# Altium schematic sheet 4-PWR_MANAGE_3.SCHDOC
size A4
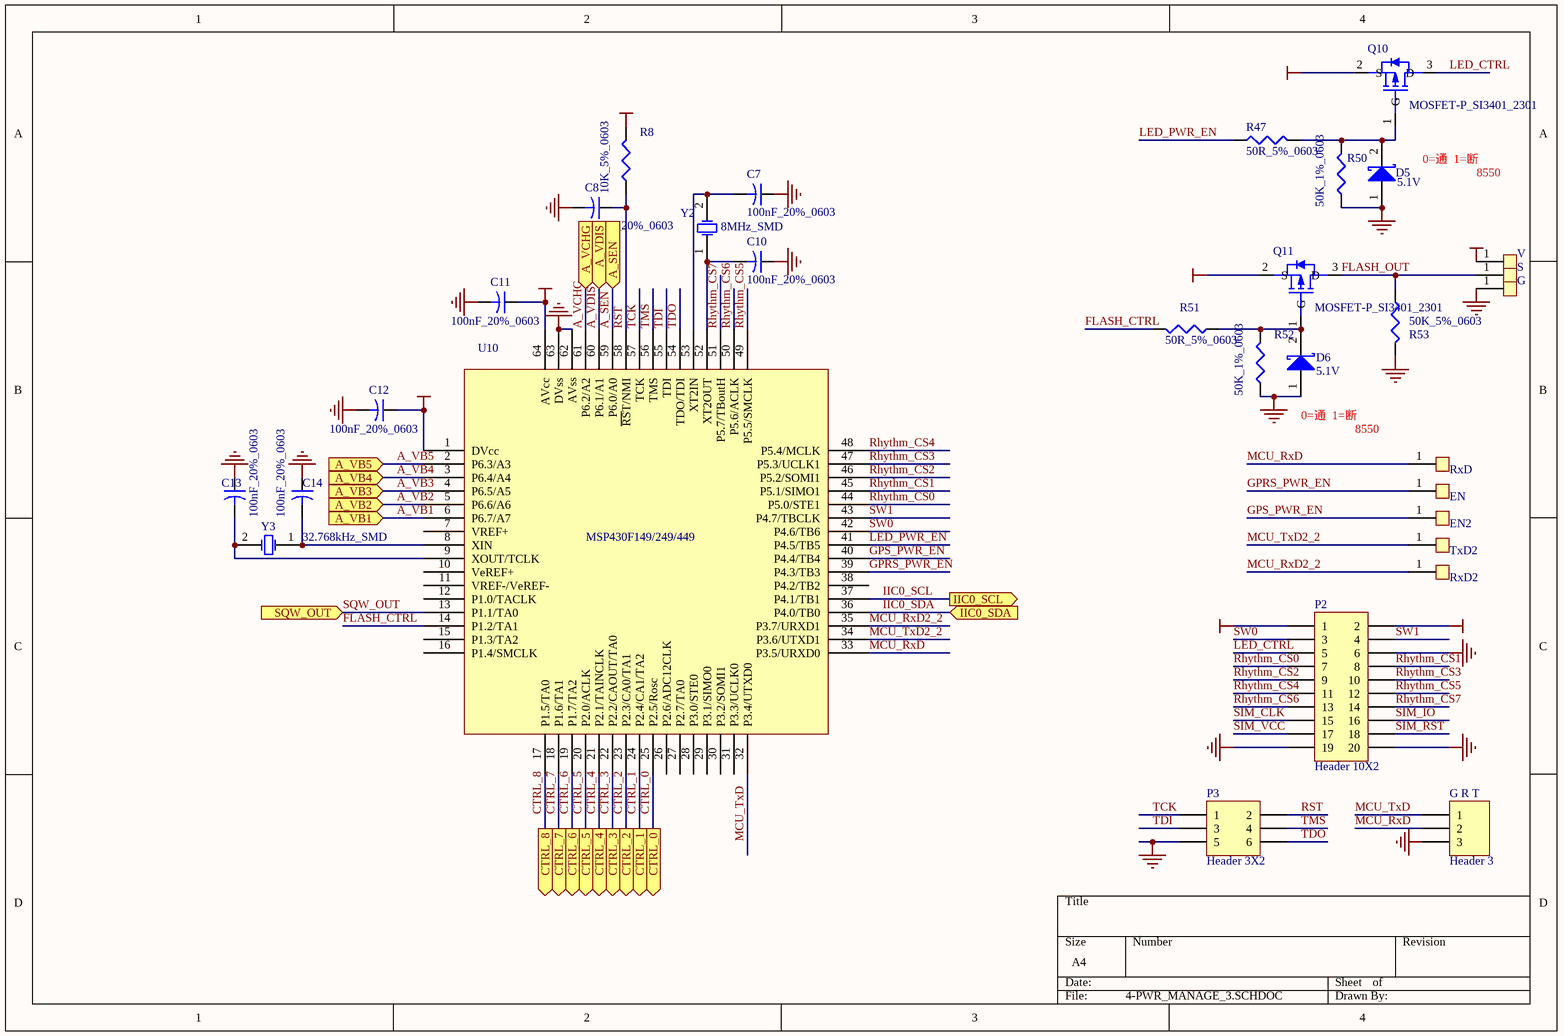
[diagram p0: 4-PWR_MANAGE_3.SCHDOC]

## Parts
C7  100nF_20%_0603  [C1608-0603]
C8  100nF_20%_0603  [C1608-0603]
C10  100nF_20%_0603  [C1608-0603]
C11  100nF_20%_0603  [C1608-0603]
C12  100nF_20%_0603  [C1608-0603]
C13  100nF_20%_0603  [C1608-0603]
C14  100nF_20%_0603  [C1608-0603]
D5  5.1V  [LED0805]
D6  5.1V  [LED0805]
EN  ND  [END_3_6]  (value not drawn)
EN2  ND  [END_3_6]  (value not drawn)
G  ND  [END_1.5_2.8]  (value not drawn)
G_R_T  Header 3  [XH-03H]
P2  Header 10X2  [HDR2X10]
P3  Header 3X2  [HDR2X3]
Q10  MOSFET-P_SI3401_2301  [SO-G3/C2.5]
Q11  MOSFET-P_SI3401_2301  [SO-G3/C2.5]
R8  10K_5%_0603  [C1608-0603]
R47  50R_5%_0603  [C1608-0603]
R50  50K_1%_0603  [C1608-0603]
R51  50R_5%_0603  [C1608-0603]
R52  50K_1%_0603  [C1608-0603]
R53  50K_5%_0603  [C1608-0603]
RxD  ND  [END_3_6]  (value not drawn)
RxD2  ND  [END_3_6]  (value not drawn)
S  ND  [END_1.5_2.8]  (value not drawn)
TxD2  ND  [END_3_6]  (value not drawn)
U10  MSP430F149/249/449  [QFP-64]
V  ND  [END_1.5_2.8]  (value not drawn)
Y2  8MHz_SMD  [XTAL-P4mm_SMD]
Y3  32.768kHz_SMD  [XTAL-3216]

## Ports
A_SEN (in), A_VB1 (in), A_VB2 (in), A_VB3 (in), A_VB4 (in), A_VB5 (in), A_VCHG (in), A_VDIS (in), CTRL_0 (out), CTRL_1 (out), CTRL_2 (out), CTRL_3 (out), CTRL_4 (out), CTRL_5 (out), CTRL_6 (out), CTRL_7 (out), CTRL_8 (out), IIC0_SCL (out), IIC0_SDA (in), SQW_OUT (in)

## Nets
GND: C7.1 C8.2 C10.1 C11.2 C12.2 C13.1 C14.1 D5.1(A) D6.1(A) G.1(SW) G_R_T.3 P2.6 P2.19 P2.20 P3.5 R50.1 R52.1 R53.2 U10.62(AVss) U10.63(DVss)
VCC_2V8: C11.1 C12.1 P2.1 P2.2 Q10.2(S) Q11.2(S) R8.2 U10.1(DVcc) U10.64(AVcc)
VCC_BAT: V.1(SW)
A_SEN: U10.59(P6.0/A0) ; port A_SEN
A_VB1: U10.6(P6.7/A7) ; port A_VB1
A_VB2: U10.5(P6.6/A6) ; port A_VB2
A_VB3: U10.4(P6.5/A5) ; port A_VB3
A_VB4: U10.3(P6.4/A4) ; port A_VB4
A_VB5: U10.2(P6.3/A3) ; port A_VB5
A_VCHG: U10.61(P6.2/A2) ; port A_VCHG
A_VDIS: U10.60(P6.1/A1) ; port A_VDIS
CTRL_0: U10.25(P2.5/Rosc) ; port CTRL_0
CTRL_1: U10.24(P2.4/CA1/TA2) ; port CTRL_1
CTRL_2: U10.23(P2.3/CA0/TA1) ; port CTRL_2
CTRL_3: U10.22(P2.2/CAOUT/TA0) ; port CTRL_3
CTRL_4: U10.21(P2.1/TAINCLK) ; port CTRL_4
CTRL_5: U10.20(P2.0/ACLK) ; port CTRL_5
CTRL_6: U10.19(P1.7/TA2) ; port CTRL_6
CTRL_7: U10.18(P1.6/TA1) ; port CTRL_7
CTRL_8: U10.17(P1.5/TA0) ; port CTRL_8
FLASH_CTRL: R51.2 U10.14(P1.2/TA1)
FLASH_OUT: Q11.3(D) R53.1 S.1(SW)
GPRS_PWR_EN: EN.1(SW) U10.39(P4.3/TB3)
GPS_PWR_EN: EN2.1(SW) U10.40(P4.4/TB4)
IIC0_SCL: U10.37(P4.1/TB1) ; port IIC0_SCL
IIC0_SDA: U10.36(P4.0/TB0) ; port IIC0_SDA
LED_CTRL: P2.5 Q10.3(D)
LED_PWR_EN: R47.1 U10.41(P4.5/TB5)
MCU_RxD: G_R_T.2 RxD.1(SW) U10.33(P3.5/URXD0)
MCU_RxD2_2: RxD2.1(SW) U10.35(P3.7/URXD1)
MCU_TxD: G_R_T.1 U10.32(P3.4/UTXD0)
MCU_TxD2_2: TxD2.1(SW) U10.34(P3.6/UTXD1)
Rhythm_CS0: P2.7 U10.44(P5.0/STE1)
Rhythm_CS1: P2.8 U10.45(P5.1/SIMO1)
Rhythm_CS2: P2.9 U10.46(P5.2/SOMI1)
Rhythm_CS3: P2.10 U10.47(P5.3/UCLK1)
Rhythm_CS4: P2.11 U10.48(P5.4/MCLK)
Rhythm_CS5: P2.12 U10.49(P5.5/SMCLK)
Rhythm_CS6: P2.13 U10.50(P5.6/ACLK)
Rhythm_CS7: P2.14 U10.51(P5.7/TBoutH)
RST: C8.1 P3.2 R8.1 U10.58(~{RS}T/NMI)
SIM_CLK: P2.15
SIM_IO: P2.16
SIM_RST: P2.18
SIM_VCC: P2.17
SQW_OUT: U10.13(P1.1/TA0) ; port SQW_OUT
SW0: P2.3 U10.42(P4.6/TB6)
SW1: P2.4 U10.43(P4.7/TBCLK)
TCK: P3.1 U10.57(TCK)
TDI: P3.3 U10.55(TDI)
TDO: P3.6 U10.54(TDO/TDI)
TMS: P3.4 U10.56(TMS)
NetC7_2: C7.2 U10.53(XT2IN) Y2.2(OSC2)
NetC10_2: C10.2 U10.52(XT2OUT) Y2.1(OSC1)
NetC13_2: C13.2 U10.9(XOUT/TCLK) Y3.2(OSC2)
NetC14_2: C14.2 U10.8(XIN) Y3.1(OSC1)
NetD5_2: D5.2(K) Q10.1(G) R47.2 R50.2
NetD6_2: D6.2(K) Q11.1(G) R51.1 R52.2

Not connected (* = marked no-connect by the designer): U10 7(VREF+) 10(VeREF+) 11(VREF-/VeREF-) 12(P1.0/TACLK) 15(P1.3/TA2) 16(P1.4/SMCLK) 26(P2.6/ADC12CLK) 27(P2.7/TA0) 28(P3.0/STE0) 29(P3.1/SIMO0) 30(P3.2/SOMI1) 31(P3.3/UCLK0) 38(P4.2/TB2)

## Notes on the sheet
- 0=通  1=断
- 8550

## Library data of the parts
C7 C8 C10-C14 = Cap2: Capacitor; Value: 0.1uF 20% 0603; Published: 23-Sep-2002; Publisher: Altium Limited
D5 D6 = D Schottky: Schottky Diode; Code - JEDEC: DO-214-AA; Published: 8-Jun-2000; Revision: July-2002: Re-released for DXP Platform.; Publisher: Altium Limited
G_R_T = Header 3: Header, 3-Pin; LatestRevisionDate: 17-Jul-2002; LatestRevisionNote: Re-released for DXP Platform.; Publisher: Altium Limited
P2 = Header 10X2: Header, 10-Pin, Dual row; LatestRevisionDate: 17-Jul-2002; LatestRevisionNote: Re-released for DXP Platform.; Publisher: Altium Limited
P3 = Header 3X2: Header, 3-Pin, Dual row; LatestRevisionDate: 17-Jul-2002; LatestRevisionNote: Re-released for DXP Platform.; Publisher: Altium Limited
Q10 Q11 = MOSFET-P
R8 R47 R50-R53 = Res3: Resistor; Value: 1K%5 0603; Published: 8-Jun-2000; Revision: July-2002: Re-released for DXP Platform.; Publisher: Altium Limited
Y2 Y3 = XTAL: Crystal Oscillator; Published: 8-Jun-2000; Revision: July-2002: Re-released for DXP Platform.; Publisher: Altium Limited